# Altium schematic sheet Processing_Rev3.SchDoc
size A
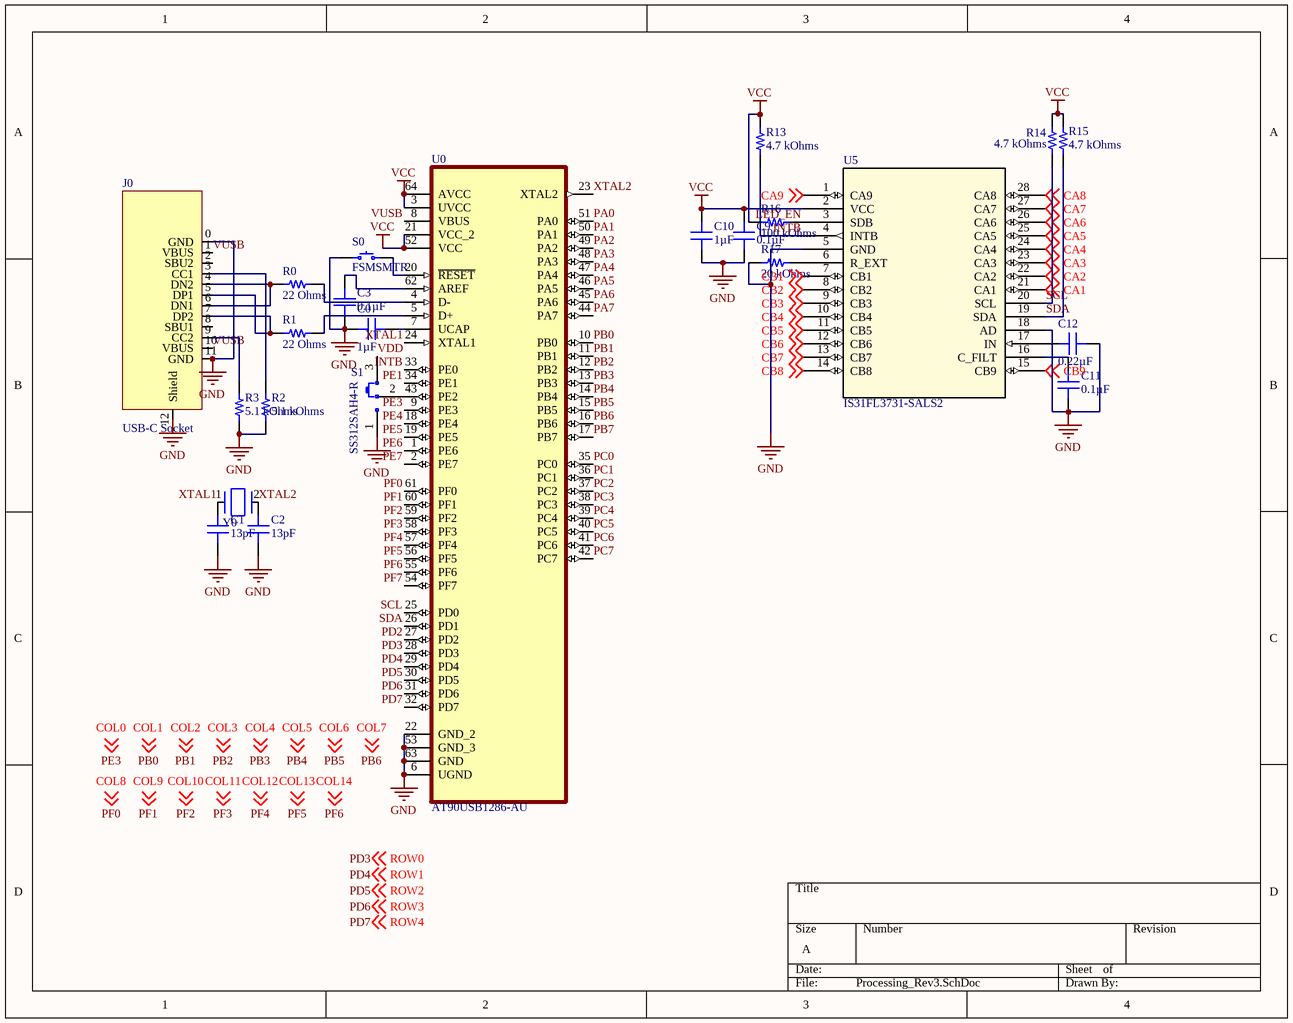
[diagram p0: Processing_Rev3.SchDoc]

## Parts
C0  1µF  [CAP 0805_2012]
C1  13pF  [CAP 0805_2012]
C2  13pF  [CAP 0805_2012]
C3  0.1µF  [CAP 0805_2012]
C9  0.1µF  [CAP 0805_2012]
C10  1µF  [CAP 0805_2012]
C11  0.1µF  [CAP 0805_2012]
C12  0.22µF  [CAP 0805_2012]
J0  USB-C Socket  [TYPE-C-31-M-12]
R0  22 Ohms  [RES 0805_2012]
R1  22 Ohms  [RES 0805_2012]
R2  5.1 kOhms  [RES 0805_2012]
R3  5.1 kOhms  [RES 0805_2012]
R13  4.7 kOhms  [RES 0805_2012]
R14  4.7 kOhms  [RES 0805_2012]
R15  4.7 kOhms  [RES 0805_2012]
R16  100 kOhms  [RES 0805_2012]
R17  20 kOhms  [RES 0805_2012]
S0  FSMSMTR  [TE FSMSMTR]
S1  SS312SAH4-R  [NKK SS312SAH4]
U0  AT90USB1286-AU  [QFP80P1600X1600X120-64N]
U5  IS31FL3731-SALS2  [SSOP-28_ISI]
Y0  9B-16.000MEEJ-B  [9B-16.000MEEJ-B]  (value not drawn)

## Nets
GND: C0.1 C1.1 C2.1 C3.1 C9.2 C10.2 C11.1 C12.1 J0.0(GND) J0.11(GND) J0.12(Shield) R2.1 R3.1 R17.2 S0.1 S1.1 U0.6(UGND) U0.22(GND_2) U0.53(GND_3) U0.63(GND) U5.5(GND) U5.18(AD)
VCC: C9.1 C10.1 R13.2 R14.2 R15.2 R16.1 U0.3(UVCC) U0.21(VCC_2) U0.52(VCC) U0.64(AVCC) U5.2(VCC)
CA1: U5.21(CA1) ; off-sheet CA1
CA2: U5.22(CA2) ; off-sheet CA2
CA3: U5.23(CA3) ; off-sheet CA3
CA4: U5.24(CA4) ; off-sheet CA4
CA5: U5.25(CA5) ; off-sheet CA5
CA6: U5.26(CA6) ; off-sheet CA6
CA7: U5.27(CA7) ; off-sheet CA7
CA8: U5.28(CA8) ; off-sheet CA8
CA9: U5.1(CA9) ; off-sheet CA9
CB1: U5.7(CB1) ; off-sheet CB1
CB2: U5.8(CB2) ; off-sheet CB2
CB3: U5.9(CB3) ; off-sheet CB3
CB4: U5.10(CB4) ; off-sheet CB4
CB5: U5.11(CB5) ; off-sheet CB5
CB6: U5.12(CB6) ; off-sheet CB6
CB7: U5.13(CB7) ; off-sheet CB7
CB8: U5.14(CB8) ; off-sheet CB8
CB9: U5.15(CB9) ; off-sheet CB9
INTB: R13.1 U0.33(PE0) U5.4(INTB)
LED_EN: R16.2 U5.3(SDB)
PA0: U0.51(PA0)
PA1: U0.50(PA1)
PA2: U0.49(PA2)
PA3: U0.48(PA3)
PA4: U0.47(PA4)
PA5: U0.46(PA5)
PA6: U0.45(PA6)
PA7: U0.44(PA7)
PB0: U0.10(PB0) ; off-sheet COL1  [also labelled COL1]
PB1: U0.11(PB1) ; off-sheet COL2  [also labelled COL2]
PB2: U0.12(PB2) ; off-sheet COL3  [also labelled COL3]
PB3: U0.13(PB3) ; off-sheet COL4  [also labelled COL4]
PB4: U0.14(PB4) ; off-sheet COL5  [also labelled COL5]
PB5: U0.15(PB5) ; off-sheet COL6  [also labelled COL6]
PB6: U0.16(PB6) ; off-sheet COL7  [also labelled COL7]
PB7: U0.17(PB7)
PC0: U0.35(PC0)
PC1: U0.36(PC1)
PC2: U0.37(PC2)
PC3: U0.38(PC3)
PC4: U0.39(PC4)
PC5: U0.40(PC5)
PC6: U0.41(PC6)
PC7: U0.42(PC7)
PD2: U0.27(PD2)
PD3: U0.28(PD3) ; off-sheet ROW0  [also labelled ROW0]
PD4: U0.29(PD4) ; off-sheet ROW1  [also labelled ROW1]
PD5: U0.30(PD5) ; off-sheet ROW2  [also labelled ROW2]
PD6: U0.31(PD6) ; off-sheet ROW3  [also labelled ROW3]
PD7: U0.32(PD7) ; off-sheet ROW4  [also labelled ROW4]
PE1: U0.34(PE1)
PE3: U0.9(PE3) ; off-sheet COL0  [also labelled COL0]
PE4: U0.18(PE4)
PE5: U0.19(PE5)
PE6: U0.1(PE6)
PE7: U0.2(PE7)
PF0: U0.61(PF0) ; off-sheet COL8  [also labelled COL8]
PF1: U0.60(PF1) ; off-sheet COL9  [also labelled COL9]
PF2: U0.59(PF2) ; off-sheet COL10  [also labelled COL10]
PF3: U0.58(PF3) ; off-sheet COL11  [also labelled COL11]
PF4: U0.57(PF4) ; off-sheet COL12  [also labelled COL12]
PF5: U0.56(PF5) ; off-sheet COL13  [also labelled COL13]
PF6: U0.55(PF6) ; off-sheet COL14  [also labelled COL14]
PF7: U0.54(PF7)
SCL: R14.1 U0.25(PD0) U5.20(SCL)
SDA: R15.1 U0.26(PD1) U5.19(SDA)
VDD: S1.3
VUSB: J0.1(VBUS) J0.10(VBUS) U0.8(VBUS)
XTAL1: C1.2 U0.24(XTAL1) Y0.1
XTAL2: C2.2 U0.23(XTAL2) Y0.2
NetC0_2: C0.2 U0.7(UCAP)
NetC3_2: C3.2 U0.62(AREF)
NetC11_2: C11.2 U5.16(C_FILT)
NetC12_2: C12.2 U5.17(IN)
NetJ0_3: J0.3(CC1) R2.2
NetJ0_4: J0.4(DN2) J0.6(DN1) R0.1
NetJ0_5: J0.5(DP1) J0.7(DP2) R1.1
NetJ0_9: J0.9(CC2) R3.2
NetR0_2: R0.2 U0.4(D-)
NetR1_2: R1.2 U0.5(D+)
NetR17_1: R17.1 U5.6(R_EXT)
NetS0_2: S0.2 U0.20(~{RESET})
NetS1_2: S1.2(COM) U0.43(PE2)

Not connected (* = marked no-connect by the designer): J0 2(SBU2) 8(SBU1)

## Library data of the parts
C0 C10 = GRM219R7YA105KA12D: CAP CER 1UF 35V X7R 0805; Manufacturer: Murata Electronics; Tolerance: ±10%; Part Number: GRM219R7YA105KA12D; Value: 1µF; Applications: General Purpose; Capacitance: 1µF; ComponentLink1Description: Datasheet; ComponentLink1URL: https://search.murata.co.jp/Ceramy/image/img/A01X/G101/ENG/GRM219R7YA105KA12-01.pdf; ComponentLink2Description: DigiKey Link; ComponentLink2URL: http://digikey.com/product-detail/en/murata-electronics/GRM219R7YA105KA12D/490-10494-1-ND/5026417; Device Package: 0805 (2012 Metric); LastUpdated: 1/21/2020 12:02:41 AM; Lifecycle Status: Active; Minimum Order: 1; Mounting Type: Surface Mount, MLCC; Operating Temperature: -55°C ~ 125°C; Package / Case: 0805 (2012 Metric); Packaging: TapeAndReel; PartId: 16877; Part Status: Active; Price: 0.05; Series: GRM; Size / Dimension: 0.079" L x 0.049" W (2.00mm x 1.25mm); Supplier 1: DigiKey; Supplier Part Number 1: 490-10494-1-ND; Temperature Coefficient: X7R; Thickness (Max): 0.037" (0.95mm); Voltage - Rated: 35V
C1 C2 = CBR08C130JAGAC: CAP CER 13PF 250V C0G/NP0 0805; Manufacturer: KEMET; Temperature Coefficient: C0G, NP0; Tolerance: ±5%; Part Number: CBR08C130JAGAC; Value: 13pF; Applications: RF, Microwave, High Frequency; Capacitance: 13pF; ComponentLink1Description: Datasheet; ComponentLink1URL: https://api.kemet.com/component-edge/download/datasheet/CBR08C130JAGAC.pdf; ComponentLink2Description: DigiKey Link; ComponentLink2URL: http://digikey.com/product-detail/en/kemet/CBR08C130JAGAC/399-8694-1-ND/3480285; Device Package: 0805 (2012 Metric); Features: High Q, Low Loss, Ultra Low ESR; LastUpdated: 1/21/2020 12:03:06 AM; Lifecycle Status: Active; Minimum Order: 1; Mounting Type: Surface Mount, MLCC; Operating Temperature: -55°C ~ 125°C; Package / Case: 0805 (2012 Metric); Packaging: TapeAndReel; PartId: 2446; Part Status: Active; Price: 0.50; Series: CBR-SMD RF C0G; Size / Dimension: 0.079" L x 0.049" W (2.00mm x 1.25mm); Supplier 1: DigiKey; Supplier Part Number 1: 399-8694-1-ND; Thickness (Max): 0.035" (0.88mm); Voltage - Rated: 250V
C3 C9 C11 = GRM21B7U1A104JA01L: CAP CER 0.1UF 10V U2J 0805; Manufacturer: Murata Electronics; Tolerance: ±5%; Part Number: GRM21B7U1A104JA01L; Value: 0.1µF; Applications: General Purpose; Capacitance: 0.1µF; ComponentLink1Description: Datasheet; ComponentLink1URL: https://search.murata.co.jp/Ceramy/image/img/A01X/G101/ENG/GRM21B7U1A104JA01-01.pdf; ComponentLink2Description: DigiKey Link; ComponentLink2URL: http://digikey.com/product-detail/en/murata-electronics/GRM21B7U1A104JA01L/490-11592-1-ND/5333432; Device Package: 0805 (2012 Metric); LastUpdated: 1/21/2020 12:02:41 AM; Lifecycle Status: Active; Minimum Order: 1; Mounting Type: Surface Mount, MLCC; Operating Temperature: -55°C ~ 125°C; Package / Case: 0805 (2012 Metric); Packaging: TapeAndReel; PartId: 16804; Part Status: Active; Price: 0.09; Series: GRM; Size / Dimension: 0.079" L x 0.049" W (2.00mm x 1.25mm); Supplier 1: DigiKey; Supplier Part Number 1: 490-11592-1-ND; Temperature Coefficient: U2J; Thickness (Max): 0.053" (1.35mm); Voltage - Rated: 10V
C12 = GCM21BR71H224KA37L: CAP CER 0.22UF 50V X7R 0805; Manufacturer: Murata Electronics; Tolerance: ±10%; Part Number: GCM21BR71H224KA37L; Value: 0.22µF; Applications: Automotive; Capacitance: 0.22µF; ComponentLink1Description: Datasheet; ComponentLink1URL: https://www.murata.com/~/media/webrenewal/support/library/catalog/products/capacitor/mlcc/c03e.ashx?la=en-us; ComponentLink2Description: DigiKey Link; ComponentLink2URL: http://digikey.com/product-detail/en/murata-electronics/GCM21BR71H224KA37L/490-4970-1-ND/1765289; Device Package: 0805 (2012 Metric); LastUpdated: 1/21/2020 12:03:05 AM; Lifecycle Status: Active; Minimum Order: 1; Mounting Type: Surface Mount, MLCC; Operating Temperature: -55°C ~ 125°C; Package / Case: 0805 (2012 Metric); Packaging: TapeAndReel; PartId: 2725; Part Status: Active; Price: 0.08; Ratings: AEC-Q200; Series: GCM; Size / Dimension: 0.079" L x 0.049" W (2.00mm x 1.25mm); Supplier 1: DigiKey; Supplier Part Number 1: 490-4970-1-ND; Temperature Coefficient: X7R; Thickness (Max): 0.055" (1.40mm); Voltage - Rated: 50V
J0 = TYPE-C-31-M-12
R0 R1 = ERA-6AHD220V: RES 22 OHM 0.5% 1/8W 0805; Manufacturer: Panasonic Electronic Components; Power (Watts): 0.125W, 1/8W; Temperature Coefficient: ±50ppm/°C; Part Number: ERA-6AHD220V; Value: 22 Ohms; ComponentLink1Description: Datasheet; ComponentLink1URL: https://industrial.panasonic.com/cdbs/www-data/pdf/RDM0000/AOA0000C307.pdf; ComponentLink2Description: DigiKey Link; ComponentLink2URL: http://digikey.com/product-detail/en/panasonic-electronic-components/ERA-6AHD220V/P123893CT-ND/9467822; Composition: Thin Film; Device Package: 0805 (2012 Metric); Features: Automotive AEC-Q200; Height - Seated (Max): 0.024" (0.60mm); LastUpdated: 1/21/2020 1:42:40 AM; Lifecycle Status: Active; Minimum Order: 1; Number of Terminations: 2; Operating Temperature: -55°C ~ 155°C; Package / Case: 0805 (2012 Metric); Packaging: TapeAndReel; PartId: 44407; Part Status: Active; Price: 0.01; Ratings: AEC-Q200; Resistance: 22 Ohms; Series: ERA-6A; Size / Dimension: 0.079" L x 0.049" W (2.00mm x 1.25mm); Supplier 1: DigiKey; Supplier Part Number 1: P123893CT-ND; Supplier Device Package: 0805; Tolerance: ±0.5%
R2 R3 = ERJ-6ENF5101V: RES SMD 5.1K OHM 1% 1/8W 0805; Manufacturer: Panasonic Electronic Components; Power (Watts): 0.125W, 1/8W; Temperature Coefficient: ±100ppm/°C; Part Number: ERJ-6ENF5101V; Value: 5.1 kOhms; ComponentLink1Description: Datasheet; ComponentLink1URL: https://industrial.panasonic.com/cdbs/www-data/pdf/RDA0000/AOA0000C304.pdf; ComponentLink2Description: DigiKey Link; ComponentLink2URL: http://digikey.com/product-detail/en/panasonic-electronic-components/ERJ-6ENF5101V/P5.10KCCT-ND/1746877; Composition: Thick Film; Device Package: 0805 (2012 Metric); Features: Automotive AEC-Q200; Height - Seated (Max): 0.028" (0.70mm); LastUpdated: 1/21/2020 1:48:57 AM; Lifecycle Status: Active; Minimum Order: 1; Number of Terminations: 2; Operating Temperature: -55°C ~ 155°C; Package / Case: 0805 (2012 Metric); Packaging: TapeAndReel; PartId: 30273; Part Status: Active; Price: 0.01; Ratings: AEC-Q200; Resistance: 5.1 kOhms; Series: ERJ; Size / Dimension: 0.079" L x 0.049" W (2.00mm x 1.25mm); Supplier 1: DigiKey; Supplier Part Number 1: P5.10KCCT-ND; Supplier Device Package: 0805; Tolerance: ±1%
R13-R15 = ERJ-6ENF4701V: RES SMD 4.7K OHM 1% 1/8W 0805; Manufacturer: Panasonic Electronic Components; Power (Watts): 0.125W, 1/8W; Temperature Coefficient: ±100ppm/°C; Part Number: ERJ-6ENF4701V; Value: 4.7 kOhms; ComponentLink1Description: Datasheet; ComponentLink1URL: https://industrial.panasonic.com/cdbs/www-data/pdf/RDA0000/AOA0000C304.pdf; ComponentLink2Description: DigiKey Link; ComponentLink2URL: http://digikey.com/product-detail/en/panasonic-electronic-components/ERJ-6ENF4701V/P4.70KCCT-ND/1746872; Composition: Thick Film; Device Package: 0805 (2012 Metric); Features: Automotive AEC-Q200; Height - Seated (Max): 0.028" (0.70mm); LastUpdated: 1/21/2020 1:48:04 AM; Lifecycle Status: Active; Minimum Order: 1; Number of Terminations: 2; Operating Temperature: -55°C ~ 155°C; Package / Case: 0805 (2012 Metric); Packaging: TapeAndReel; PartId: 32254; Part Status: Active; Price: 0.01; Ratings: AEC-Q200; Resistance: 4.7 kOhms; Series: ERJ; Size / Dimension: 0.079" L x 0.049" W (2.00mm x 1.25mm); Supplier 1: DigiKey; Supplier Part Number 1: P4.70KCCT-ND; Supplier Device Package: 0805; Tolerance: ±1%
R16 = ERJ-6ENF1003V: RES SMD 100K OHM 1% 1/8W 0805; Manufacturer: Panasonic Electronic Components; Power (Watts): 0.125W, 1/8W; Temperature Coefficient: ±100ppm/°C; Part Number: ERJ-6ENF1003V; Value: 100 kOhms; ComponentLink1Description: Datasheet; ComponentLink1URL: https://industrial.panasonic.com/cdbs/www-data/pdf/RDA0000/AOA0000C304.pdf; ComponentLink2Description: DigiKey Link; ComponentLink2URL: http://digikey.com/product-detail/en/panasonic-electronic-components/ERJ-6ENF1003V/P100KCCT-ND/119551; Composition: Thick Film; Device Package: 0805 (2012 Metric); Features: Automotive AEC-Q200; Height - Seated (Max): 0.028" (0.70mm); LastUpdated: 1/21/2020 1:48:04 AM; Lifecycle Status: Active; Minimum Order: 1; Number of Terminations: 2; Operating Temperature: -55°C ~ 155°C; Package / Case: 0805 (2012 Metric); Packaging: TapeAndReel; PartId: 32252; Part Status: Active; Price: 0.01; Ratings: AEC-Q200; Resistance: 100 kOhms; Series: ERJ; Size / Dimension: 0.079" L x 0.049" W (2.00mm x 1.25mm); Supplier 1: DigiKey; Supplier Part Number 1: P100KCCT-ND; Supplier Device Package: 0805; Tolerance: ±1%
R17 = ERA-6AEB203V: RES 20K OHM 0.1% 1/8W 0805; Manufacturer: Panasonic Electronic Components; Power (Watts): 0.125W, 1/8W; Temperature Coefficient: ±25ppm/°C; Part Number: ERA-6AEB203V; Value: 20 kOhms; ComponentLink1Description: Datasheet; ComponentLink1URL: https://industrial.panasonic.com/cdbs/www-data/pdf/RDM0000/AOA0000C307.pdf; ComponentLink2Description: DigiKey Link; ComponentLink2URL: http://digikey.com/product-detail/en/panasonic-electronic-components/ERA-6AEB203V/P20KDACT-ND/1465978; Composition: Thin Film; Device Package: 0805 (2012 Metric); Features: Automotive AEC-Q200; Height - Seated (Max): 0.024" (0.60mm); LastUpdated: 1/21/2020 1:49:56 AM; Lifecycle Status: Active; Minimum Order: 1; Number of Terminations: 2; Operating Temperature: -55°C ~ 155°C; Package / Case: 0805 (2012 Metric); Packaging: TapeAndReel; PartId: 28073; Part Status: Active; Price: 0.04; Ratings: AEC-Q200; Resistance: 20 kOhms; Series: ERA-6A; Size / Dimension: 0.079" L x 0.049" W (2.00mm x 1.25mm); Supplier 1: DigiKey; Supplier Part Number 1: P20KDACT-ND; Supplier Device Package: 0805; Tolerance: ±0.1%
S0 = FSMSMTR: SWITCH TACTILE SPST-NO 0.05A 24V; Manufacturer: TE Connectivity ALCOSWITCH Switches; Actuator Height off PCB, Vertical: 4.57mm; Actuator Orientation: Top Actuated; Actuator Type: Standard; Contact Rating @ Voltage: 0.05A @ 24VDC; Illumination: Non-Illuminated; Operating Force: 180gf; Outline: 6.00mm x 3.50mm; Switch Function: Off-Mom; Part Number: FSMSMTR; Circuit: SPST-NO; ComponentLink1Description: Datasheet; ComponentLink1URL: https://www.te.com/commerce/DocumentDelivery/DDEController?Action=srchrtrv&DocNm=1437566-3&DocType=Customer+Drawing&DocLang=English; ComponentLink2Description: DigiKey Link; ComponentLink2URL: http://digikey.com/product-detail/en/te-connectivity-alcoswitch-switches/FSMSMTR/450-1758-1-ND/2271637; LastUpdated: 1/25/2020 8:03:55 PM; Lifecycle Status: Active; Minimum Order: 1; Mounting Type: Surface Mount; Operating Temperature: -35°C ~ 85°C; Packaging: TapeAndReel; Part Status: Active; Price: 0.19; Series: FSMSM; Supplier 1: DigiKey; Supplier Part Number 1: 450-1758-1-ND; Termination Style: Gull Wing
S1 = SS312SAH4-R: SWITCH SLIDE SPDT 0.4VA 28V; Manufacturer: NKK Switches; Actuator Length: 2.00mm; Actuator Type: Standard; Contact Timing: Shorting (MBB); Current Rating (Amps): 0.4VA (AC/DC); Switch Function: On-On; Part Number: SS312SAH4-R; Circuit: SPDT; ComponentLink1Description: Datasheet; ComponentLink1URL: http://www.nkkswitches.com/pdf/SS3surfaceMount-1.pdf; ComponentLink2Description: DigiKey Link; ComponentLink2URL: http://digikey.com/product-detail/en/nkk-switches/SS312SAH4-R/360-2924-1-ND/1051215; Contact Finish: Gold; Contact Material: Phosphor Bronze; LastUpdated: 1/4/2020 7:10:14 PM; Lifecycle Status: Active; Minimum Order: 1; Mounting Type: Surface Mount, Right Angle; Operating Temperature: -25°C ~ 85°C; Packaging: TapeAndReel; PartId: 1; Part Status: Active; Price: 1.95; Series: SS3; Supplier 1: DigiKey; Supplier Part Number 1: 360-2924-1-ND; Termination Style: Gull Wing; Voltage Rating - AC: 28V; Voltage Rating - DC: 28V
U0 = AT90USB1286-AU: AVR AVRÂ® 90USB Microcontroller IC 8-Bit 16MHz 128KB _128K x 8_ FLASH 64-TQFP _14x14_; MF: Microchip; Value: *; Package: TQFP-64 Microchip; Price: None; MP: AT90USB1286-AU; Availability: Unavailable; SnapEDA_Link: https://www.snapeda.com/parts/AT90USB1286-AU/Microchip/view-part/598497/?ref=snap
U5 = IS31FL3731-SALS2: No Description Available; Vendor: ISSI; Built_By: EMA_Cory; SourceLibrary: ISSI_2020-02-04; Datasheet: http://www.issi.com/WW/pdf/31FL3731.pdf; Manufacturer_Part_Number: IS31FL3731-SALS2; Copyright: Copyright (C) 2018 Accelerated Designs. All rights reserved; RefDes: RefDes; Type: DEV
Y0 = 9B-16.000MEEJ-B: CRYS 16MHz ±10ppm Crystal 18pF 30 Ohm -20°C ~ 70°C Through Hole HC49/US; Part Number: ABL-16.000MHZ-B2; Manufacturer: Abracon; Frequency Tolerance: ±20ppm; Frequency Stability: ±50ppm; ESR: 40 Ohm; Operating Mode: Fundamental; helpURL: https://upverter.com/upn/revision/7ebf07e1da2eb130/; ComponentLink2Description: Datasheet; Temperature: 0ºC to +70ºC; Package: HC/49US; Supplier 2: Mouser; Price: 0.175999999027; Supplier 1: Digi-Key; ComponentLink1URL: https://upverter.com/upn/revision/7ebf07e1da2eb130/; Supplier Part Number 2: 815-ABL-16-B2; Supplier Part Number 1: 535-9041-ND; ComponentLink1Description: Upverter; ComponentLink2URL: http://www.abracon.com/Resonators/ABL.pdf; RoHS: TRUE; Mouser Part Number: 815-ABL-16-B2; Temperature Range High: +70ºC; Digikey Description: CRYS 16MHz ±20ppm Crystal 18pF 40 Ohm -20°C ~ 70°C Through Hole HC49/US; Digikey Part Number: 535-9041-ND; Lead Free: yes; Temperature Range Low: 0ºC; Load Capacitance: 18pF; Frequency: 16MHz